# EAGLE design Prototipado rapido v2 (EAGLE 9.7.0)
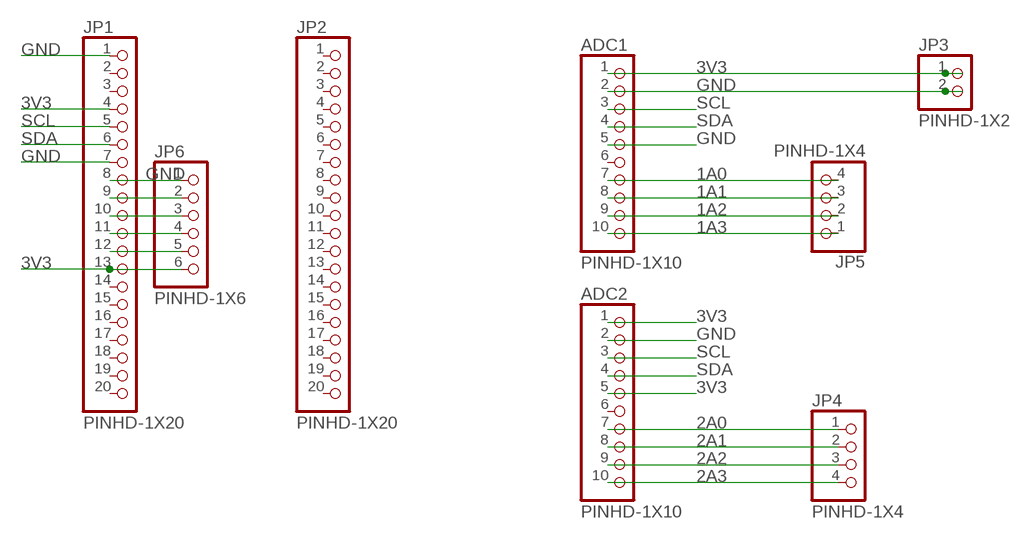
[diagram p0: schematic, sheet 1]

## Parts
ADC1  PINHD-1X10  [1X10]
ADC2  PINHD-1X10  [1X10]
JP1  PINHD-1X20  [1X20]
JP2  PINHD-1X20  [1X20]
JP3  PINHD-1X2  [1X02]
JP4  PINHD-1X4  [1X04]
JP5  PINHD-1X4  [1X04]
JP6  PINHD-1X6  [1X06]

## Nets
1A0: ADC1.7 JP5.4
1A1: ADC1.8 JP5.3
1A2: ADC1.9 JP5.2
1A3: ADC1.10 JP5.1
2A0: ADC2.7 JP4.1
2A1: ADC2.8 JP4.2
2A2: ADC2.9 JP4.3
2A3: ADC2.10 JP4.4
3V3: ADC1.1 ADC2.1 ADC2.5 JP1.4 JP1.13 JP3.1 JP6.6
GND: ADC1.2 ADC1.5 ADC2.2 JP1.1 JP1.7 JP1.8 JP3.2 JP6.1
N$1: JP1.12 JP6.5
N$2: JP1.11 JP6.4
N$3: JP1.10 JP6.3
N$4: JP1.9 JP6.2
SCL: ADC1.3 ADC2.3 JP1.5
SDA: ADC1.4 ADC2.4 JP1.6
Unconnected: ADC1.6 ADC2.6 JP1.2 JP1.3 JP1.14 JP1.15 JP1.16 JP1.17 JP1.18 JP1.19 JP1.20 JP2.1 JP2.2 JP2.3 JP2.4 JP2.5 JP2.6 JP2.7 JP2.8 JP2.9 JP2.10 JP2.11 JP2.12 JP2.13 JP2.14 JP2.15 JP2.16 JP2.17 JP2.18 JP2.19 JP2.20

## Library data of the parts
ADC1 ADC2 = Connector:PINHD-1X10: PIN HEADER; CATEGORY: Headers; DESCRIPTION: Header, Straight, 10 Position; MANUFACTURER: Generic; MPN: Generic; OPERATING_TEMPERATURE: Generic; PART_STATUS: Active; PITCH: 0.100" (2.54mm); ROHS_COMPLIANCE: Generic; SERIES: Generic; SUB-CATEGORY: Headers, Male Pins; TYPE: Board to Board or Cable, Unshrouded, Through Hole, Straight
JP1 JP2 = Connector:PINHD-1X20: PIN HEADER; CATEGORY: Headers; DESCRIPTION: Header, Straight, 10 Position; MANUFACTURER: Generic; MPN: Generic; OPERATING_TEMPERATURE: Generic; PART_STATUS: Active; PITCH: 0.100" (2.54mm); ROHS_COMPLIANCE: Generic; SERIES: Generic; SUB-CATEGORY: Headers, Male Pins; TYPE: Board to Board or Cable, Unshrouded, Through Hole, Straight
JP3 = Connector:PINHD-1X2: PIN HEADER; CATEGORY: Headers; DESCRIPTION: Header, Straight, 2 Position; MANUFACTURER: Generic; MPN: Generic; OPERATING_TEMPERATURE: Generic; PART_STATUS: Active; PITCH: 0.100" (2.54mm); ROHS_COMPLIANCE: Generic; SERIES: Generic; SUB-CATEGORY: Headers, Male Pins; TYPE: Board to Board or Cable, Unshrouded, Through Hole, Straight
JP4 JP5 = Connector:PINHD-1X4: PIN HEADER; CATEGORY: Headers; DESCRIPTION: Header, Straight, 4 Position; MANUFACTURER: Generic; MPN: Generic; OPERATING_TEMPERATURE: Generic; PART_STATUS: Active; PITCH: 0.100" (2.54mm); ROHS_COMPLIANCE: Generic; SERIES: Generic; SUB-CATEGORY: Headers, Male Pins; TYPE: Board to Board or Cable, Unshrouded, Through Hole, Straight
JP6 = Connector:PINHD-1X6: PIN HEADER; CATEGORY: Headers; DESCRIPTION: Header, Straight, 6 Position; MANUFACTURER: Generic; MPN: Generic; OPERATING_TEMPERATURE: Generic; PART_STATUS: Active; PITCH: 0.100" (2.54mm); ROHS_COMPLIANCE: Generic; SERIES: Generic; SUB-CATEGORY: Headers, Male Pins; TYPE: Board to Board or Cable, Unshrouded, Through Hole, Straight

## Board
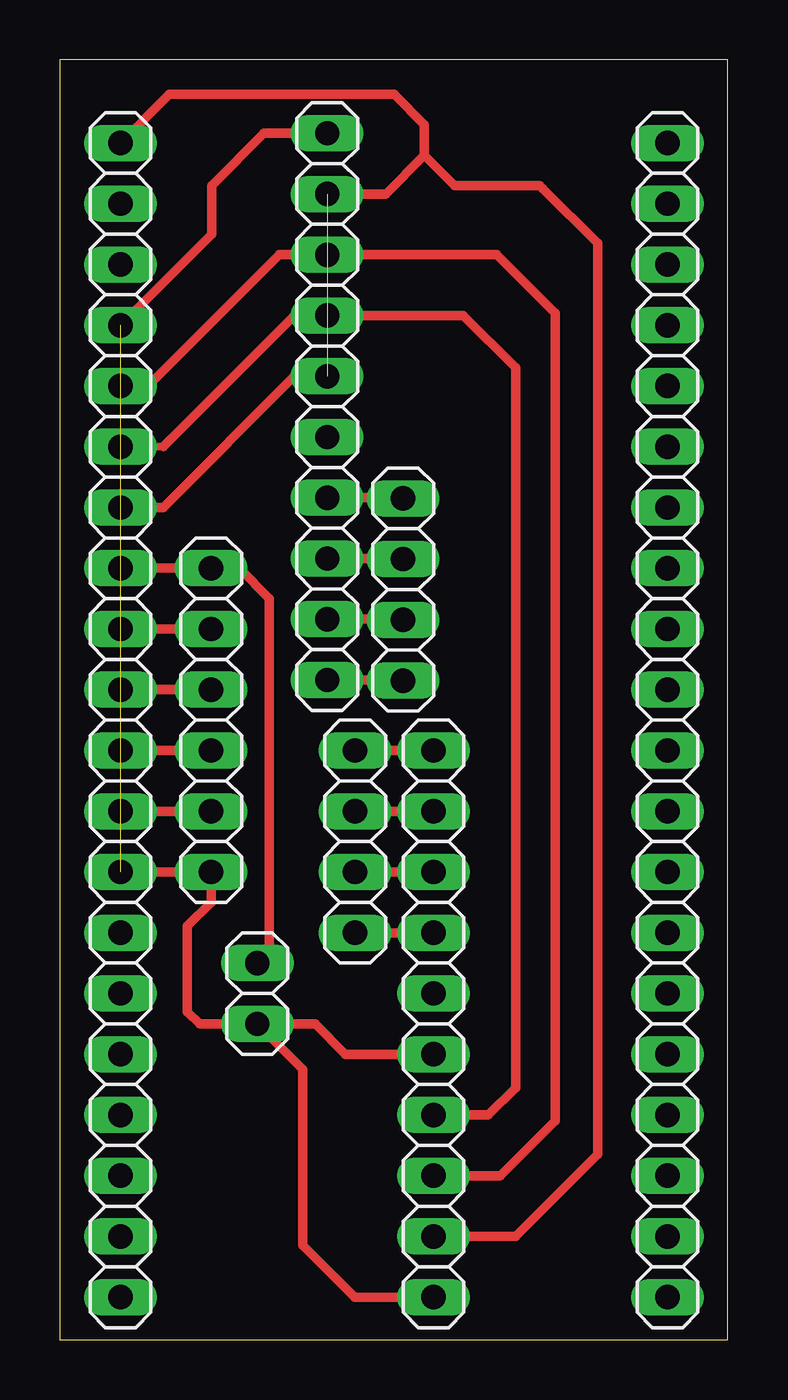
[diagram p1: board, top side]

Size 27.92 x 53.52 mm. Coordinates in mm from the lower left corner, seen from the top.
Outline: 0,0 27.92,0 27.92,53.52 0,53.52 0,0
Copper layers (1*16): Top / Bottom
Stack-up Default Layer Stack: Top User Defined 0.035mm / Dielectric-1 User Defined 1.5mm / Bottom User Defined 0.035mm
Design rules: minimum copper width 6mil, minimum drill size 0.35mm, copper clearance wire_polygon to wire_polygon 6mil, copper clearance wire_polygon to pad_smd 6mil, copper clearance wire_polygon to via 6mil, copper clearance pad_smd to pad_smd 6mil, copper clearance pad_smd to via 6mil, copper clearance via to via 6mil, copper clearance smd to pad (same net) 6mil, copper clearance smd to via (same net) 6mil, copper clearance smd to smd (same net) 6mil, dimension clearance 40mil, via restrict clearance 0mil, restrict clearance 0mil, drill distance 6mil, keepout clearance 0mil

### Footprints (pad centres in the part's own frame; a part is rotated, then mirrored left to right if it is on the bottom)
1X10 = drill 1.016 long: 1 -11.43,0; 2 -8.89,0; 3 -6.35,0; 4 -3.81,0; 5 -1.27,0; 6 1.27,0; 7 3.81,0; 8 6.35,0; 9 8.89,0; 10 11.43,0
1X20 = drill 1.016 long: 1 -24.13,0; 2 -21.59,0; 3 -19.05,0; 4 -16.51,0; 5 -13.97,0; 6 -11.43,0; 7 -8.89,0; 8 -6.35,0; 9 -3.81,0; 10 -1.27,0; 11 1.27,0; 12 3.81,0; 13 6.35,0; 14 8.89,0; 15 11.43,0; 16 13.97,0; 17 16.51,0; 18 19.05,0; 19 21.59,0; 20 24.13,0
1X02 = drill 1.016 long: 1 -1.27,0; 2 1.27,0
1X04 = drill 1.016 long: 1 -3.81,0; 2 -1.27,0; 3 1.27,0; 4 3.81,0
1X06 = drill 1.016 long: 1 -6.35,0; 2 -3.81,0; 3 -1.27,0; 4 1.27,0; 5 3.81,0; 6 6.35,0

### Placement (x,y rotation side)
ADC1  11.18,39.01 270 top
ADC2  15.62,13.21 90 top
JP1  2.54,25.91 270 top
JP2  25.4,25.91 90 top
JP3  8.26,14.48 90 top
JP4  12.34,20.83 90 top
JP5  14.35,31.37 90 top
JP6  6.32,25.91 270 top

### Tracks (layer width: path | path; a pad name or v marks a point on that pad's centre or on a via)
1A0
  Top 0.254: 14.33,35.2 JP5.4
  Top 0.406: ADC1.7 14.33,35.2
1A1
  Top 0.406: ADC1.8 14.33,32.66 JP5.3
1A2
  Top 0.406: ADC1.9 14.33,30.12 JP5.2
1A3
  Top 0.254: 14.33,27.58 JP5.1
  Top 0.406: ADC1.10 14.33,27.58
2A0
  Top 0.406: JP4.1 ADC2.7
2A1
  Top 0.406: JP4.2 ADC2.8
2A2
  Top 0.406: JP4.3 ADC2.9
2A3
  Top 0.406: JP4.4 ADC2.10
3V3  (1 unrouted)
  Top 0.406: JP1.4 6.35,46.23 6.35,48.26 8.53,50.44 ADC1.1 | ADC2.1 12.32,1.78 10.16,3.94 10.16,11.3 JP3.1 | ADC2.5 11.94,11.94 10.67,13.21 JP3.1 | JP3.1 5.84,13.21 5.33,13.72 5.33,17.3 6.33,18.29 JP6.6 JP1.13
GND  (2 unrouted)
  Top 0.305: JP6.1 6.35,32.28 | 20.07,48.26 20.19,48.13
  Top 0.406: JP1.1 4.57,52.07 13.97,52.07 15.24,50.8 15.24,49.53 | 15.24,49.53 13.61,47.9 ADC1.2 | 15.24,49.53 16.51,48.26 20.07,48.26 | 20.19,48.13 22.48,45.85 22.48,7.75 19.05,4.32 ADC2.2 | JP1.8 JP6.1 7.49,32.26 8.76,30.99 8.76,16.26 JP3.2 | JP1.7 4.32,34.8 9.8,40.28 ADC1.5
N$1
  Top 0.406: JP6.5 JP1.12
N$2
  Top 0.406: JP1.11 JP6.4
N$3
  Top 0.406: JP6.3 JP1.10
N$4
  Top 0.406: JP1.9 JP6.2
SCL
  Top 0.406: JP1.5 3.68,39.88 9.17,45.36 ADC1.3 18.26,45.36 20.7,42.93 20.7,9.14 18.41,6.86 ADC2.3
SDA
  Top 0.305: JP1.6 4.32,37.34
  Top 0.406: 4.32,37.34 9.8,42.82 ADC1.4 16.87,42.82 19.05,40.64 19.05,10.54 17.91,9.4 ADC2.4